# Altium schematic sheet Power.SchDoc
size A4
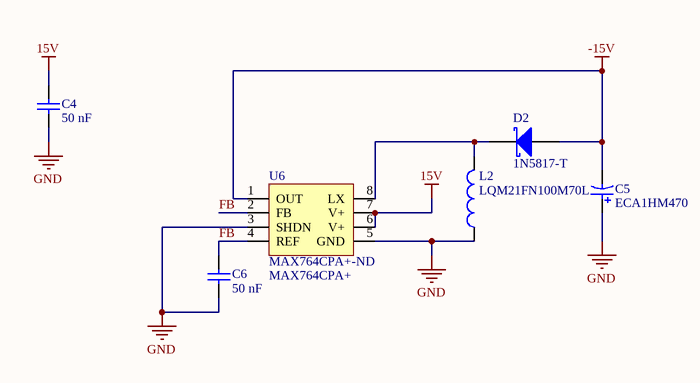
[diagram p0: Power.SchDoc]

## Parts
C4  50 nF  [CAPC0805(2012)75_M]
C5  ECA1HM470  [CAPPR55-250-1120X630X1220]
C6  50 nF  [CAPC0805(2012)75_M]
D2  1N5817-T  [DIOD-DO-41-P-2]
L2  LQM21FN100M70L  [MURA-IND0805_M]
U6  MAX764CPA+-ND  Manufacturer PN: MAX764CPA+  [PDIP300-P8]

## Nets
15V: C4.1 U6.6(V+) U6.7(V+)
-15V: C5.2 D2.1(A) U6.1(OUT)
GND: C4.2 C5.1 C6.2 L2.1 U6.3(SHDN) U6.5(GND)
FB: C6.1 U6.2(FB) U6.4(REF)
NetD2_2: D2.2(K) L2.2 U6.8(LX)

## Library data of the parts
C4 C6 = CMP-1036-00018-1: CAP 0.5pF 50V ±0.1pF 0805 (2012 Metric) Thickness 0.75mm SMD; Case-EIA: 0805; Case-Metric: 2012; Tolerance: Â±0.1pF; Value: 0.5pF; Technology: SMT; Rated Voltage: 50 V; Max Thickness: 0.75 mm
C5 = CMP-2100-03626-1: Aluminum Electrolytic Capacitor, 47 uF, +/- 20%, 50 V, -40 to 85 degC, 2-Pin THD, RoHS, Bulk; Manufacturer: Panasonic; Voltage Rating: 50V; Ripple Current: 130mA; Dissipation Factor: 0.12%; Capacitance: 47uF; Lead Diameter: 0.5mm; Lead/Base Style: Straight; Life (Hours): 2000Hour; Leakage Current: 3uA; Diameter: 6.3mm; REACH SVHC: NoSVHC; Mount: ThroughHole; Package Reference: CAPPR55-250-1120X630X1220; Package Quantity: 200; Case/Package: Radial; Voltage Rating (DC): 50V; Packaging: Bulk; Length: 11.2mm; Manufacturer URL: http://www.panasonic.com/; Datasheet URL: https://industrial.panasonic.com/cdbs/www-data/pdf/RDF0000/ABA0000C1218.pdf; Height: 11.2mm; Package Description: 2-Pin Radial Lead, Dia 6.3 mm, Height 12.2 mm; Min Operating Temperature: -40degC; Tolerance: 20%; Datasheet Version: Rev. 05, 10/2016; RoHSCompliant: true; Termination: Radial; Voltage: 50V; Radiation Hardening: No; Height - Seated (Max): 0.48inch; Max Operating Temperature: 85degC; Lead Pitch: 2.5mm
D2 = CMP-2000-05521-1: Schottky Barrier Rectifier, 1 A, 20 V, -65 to 125 degC, 2-Pin DO-41, RoHS, Tape and Reel; Manufacturer: DiodesIncorporated; Vrrm - Repetitive Reverse Voltage: 20V; If - Forward Current: 1A; Configuration: Single; Unit Weight: 0.010582oz; Type: SchottkyDiode; Ifsm - Forward Surge Current: 25A; Vf - Forward Voltage: 0.75Vat3A; Ir - Reverse Current: 1000uA; Technology: Si; Length: 5.21mm; Product: SchottkyRectifiers; Package Reference: DO-41-P-2; Package / Case: DO-41; Datasheet URL: http://www.diodes.com/_files/datasheets/ds23001.pdf; Operating Temperature Range: -65Cto+125C; Mounting Style: ThroughHole; Manufacturer URL: http://www.diodes.com/; Series: 1N58; Minimum Operating Temperature: -65C; Height: 2.72mm; Brand: DiodesIncorporated; Maximum Operating Temperature: +125C; Datasheet Version: Rev. 8-2, 05/2009; Factory Pack Quantity: 5000; Width: 2.72mm; RoHS: True; Product Category: SchottkyDiodes&Rectifiers; Package Description: 2-Pin Through Hole Device, Body 4.635 x 2.36 mm, Pin Spacing 7.85 mm; Packaging: Reel; Termination Style: ThroughHole; Mounting Technology: ThroughHole
L2 = CMP-2000-06587-1: Fixed Inductor, 10 uH, +/-20%, -55 to 125 degC, 2-Pin SMD (0805), RoHS, Tape and Reel; Manufacturer: Murata; Tolerance (%): 20%; DC Resistance: 0.6; Inductance-Nom: 10H; Rated Current-Max: 100mA; Package Reference: IND0805; Case Size/Dimension: 0805; Manufacturer URL: http://www.murata.com/; Package Description: 2-Pin Surface Mount Device, Body 2 x 1.25 mm; Datasheet URL: http://psearch.en.murata.com/inductor/product/LQM21FN100M70%23.pdf; Mounting Technology: SurfaceMount; Datasheet Version: 05/2016
U6 = MAX764CPA+-ND: IC REG BUCK BST INV ADJ/-5V 8DIP; HTML: https://www.digikey.ca/product-detail/en/maxim-integrated/MAX764CPA/MAX764CPA-ND/1512331